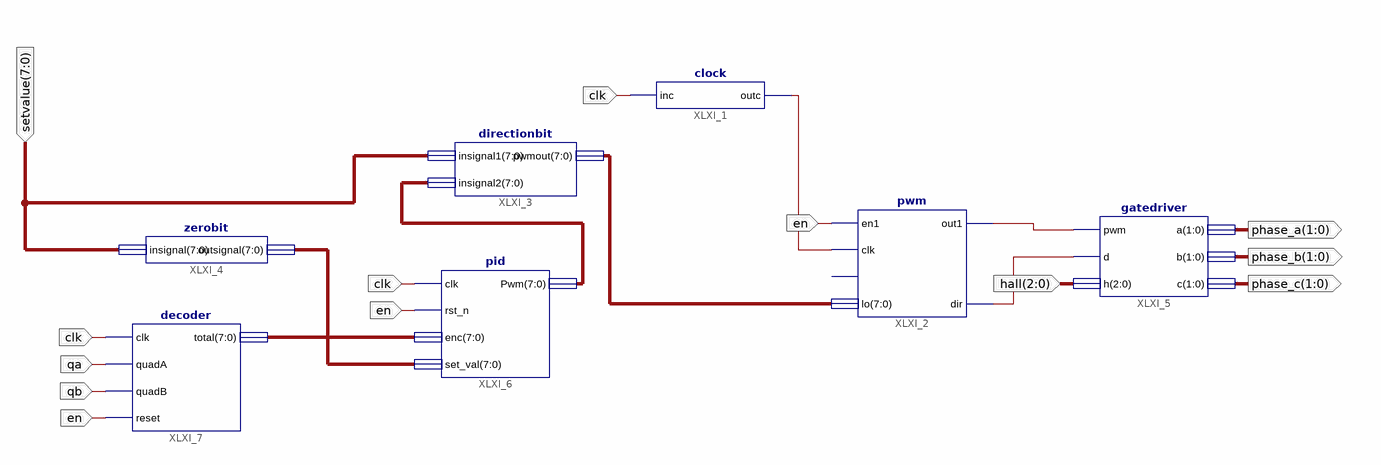
[diagram p0: schematic sheet 1]
// Xilinx ISE schematic motor_4.sch (spartan6) as structural Verilog: 7 symbols, 9 ports
module motor_4 (
  input  [7:0] setvalue,
  input  clk,
  input  qa,
  input  qb,
  input  en,
  input  [2:0] hall,
  output [1:0] phase_a,
  output [1:0] phase_b,
  output [1:0] phase_c
);

  wire XLXN_17, XLXN_18, XLXN_20;
  wire [7:0] XLXN_2, XLXN_7, XLXN_15, XLXN_21;

  clock XLXI_1 (.inc(clk), .outc(XLXN_17));
  pwm XLXI_2 (.en1(en), .clk(XLXN_17), .lo(XLXN_15), .out1(XLXN_18), .dir(XLXN_20));  // open: cl
  directionbit XLXI_3 (.insignal1(setvalue), .insignal2(XLXN_2), .pwmout(XLXN_15));
  zerobit XLXI_4 (.insignal(setvalue), .outsignal(XLXN_7));
  gatedriver XLXI_5 (.pwm(XLXN_18), .d(XLXN_20), .h(hall), .a(phase_a), .b(phase_b), .c(phase_c));
  pid XLXI_6 (.clk(clk), .rst_n(en), .enc(XLXN_21), .set_val(XLXN_7), .Pwm(XLXN_2));
  decoder XLXI_7 (.clk(clk), .quadA(qa), .quadB(qb), .reset(en), .total(XLXN_21));
endmodule
